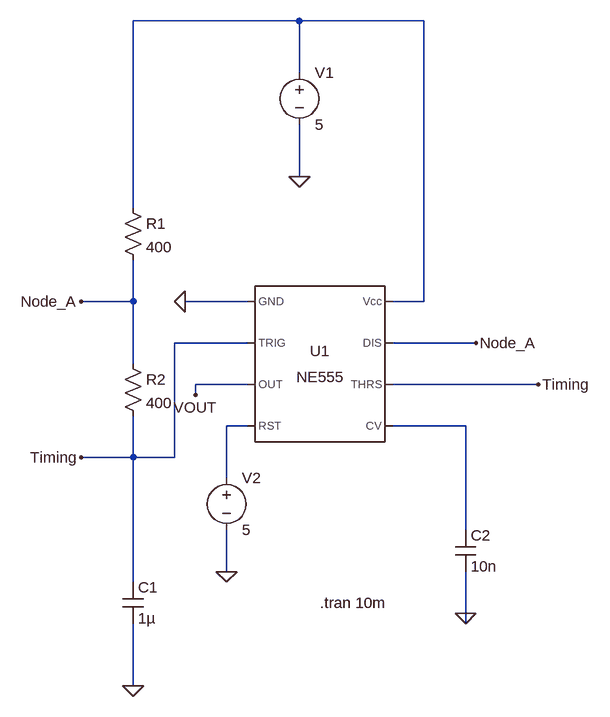
[diagram p0: schematic PWM_555.asc]
PWM_555.asc, the LTspice schematic file:
Version 4.1
SHEET 1 880 692
WIRE 208 -352 -48 -352
WIRE 400 -352 208 -352
WIRE 208 -272 208 -352
WIRE 208 -112 208 -192
WIRE -48 -64 -48 -352
WIRE -48 80 -48 16
WIRE -48 80 -128 80
WIRE 128 80 32 80
WIRE 400 80 400 -352
WIRE 400 80 352 80
WIRE 128 144 16 144
WIRE 480 144 352 144
WIRE -48 176 -48 80
WIRE 128 208 48 208
WIRE 576 208 352 208
WIRE 48 224 48 208
WIRE 128 272 96 272
WIRE 464 272 352 272
WIRE -48 320 -48 256
WIRE -48 320 -128 320
WIRE 16 320 16 144
WIRE 16 320 -48 320
WIRE 96 352 96 272
WIRE 464 432 464 272
WIRE 96 496 96 432
WIRE -48 512 -48 320
WIRE 464 560 464 496
WIRE 464 576 464 560
WIRE -48 672 -48 576
FLAG 464 560 0
FLAG 48 224 VOUT
FLAG -48 672 0
FLAG 32 80 0
FLAG -128 320 Timing
FLAG 576 208 Timing
FLAG 96 496 0
FLAG -128 80 Node_A
FLAG 480 144 Node_A
FLAG 208 -112 0
SYMBOL Misc\\NE555 240 176 R0
SYMATTR InstName U1
SYMBOL res -64 -80 R0
SYMATTR InstName R1
SYMATTR Value 400
SYMBOL res -64 160 R0
SYMATTR InstName R2
SYMATTR Value 400
SYMBOL cap -64 512 R0
SYMATTR InstName C1
SYMATTR Value 1µ
SYMATTR SpiceLine V=4 Irms=0 Rser=0 Lser=0 mfg="Murata" pn="GRM032R60G105ME05" type="X5R"
SYMBOL voltage 96 336 R0
WINDOW 123 0 0 Left 0
WINDOW 39 0 0 Left 0
SYMATTR InstName V2
SYMATTR Value 5
SYMBOL voltage 208 -288 R0
WINDOW 123 0 0 Left 0
WINDOW 39 0 0 Left 0
SYMATTR InstName V1
SYMATTR Value 5
SYMBOL cap 448 432 R0
SYMATTR InstName C2
SYMATTR Value 10n
TEXT 240 544 Left 2 !.tran 10m

The netlist it stands for:
* PWM_555.asc
X§U1 0 Timing VOUT N002 N003 Timing Node_A N001 NE555  ; pins GND TRIG OUT RST CV THRS DIS Vcc
R1 N001 Node_A 400
R2 Node_A Timing 400
C1 Timing 0 1µ V=4 Irms=0 Rser=0 Lser=0 mfg="Murata" pn="GRM032R60G105ME05" type="X5R"
V2 N002 0 5
V1 N001 0 5
C2 N003 0 10n
.tran 10m
.lib NE555.sub
.backanno
.end